# EAGLE schematic Shopfloor HP Molex NEW (EAGLE 9.6.2)
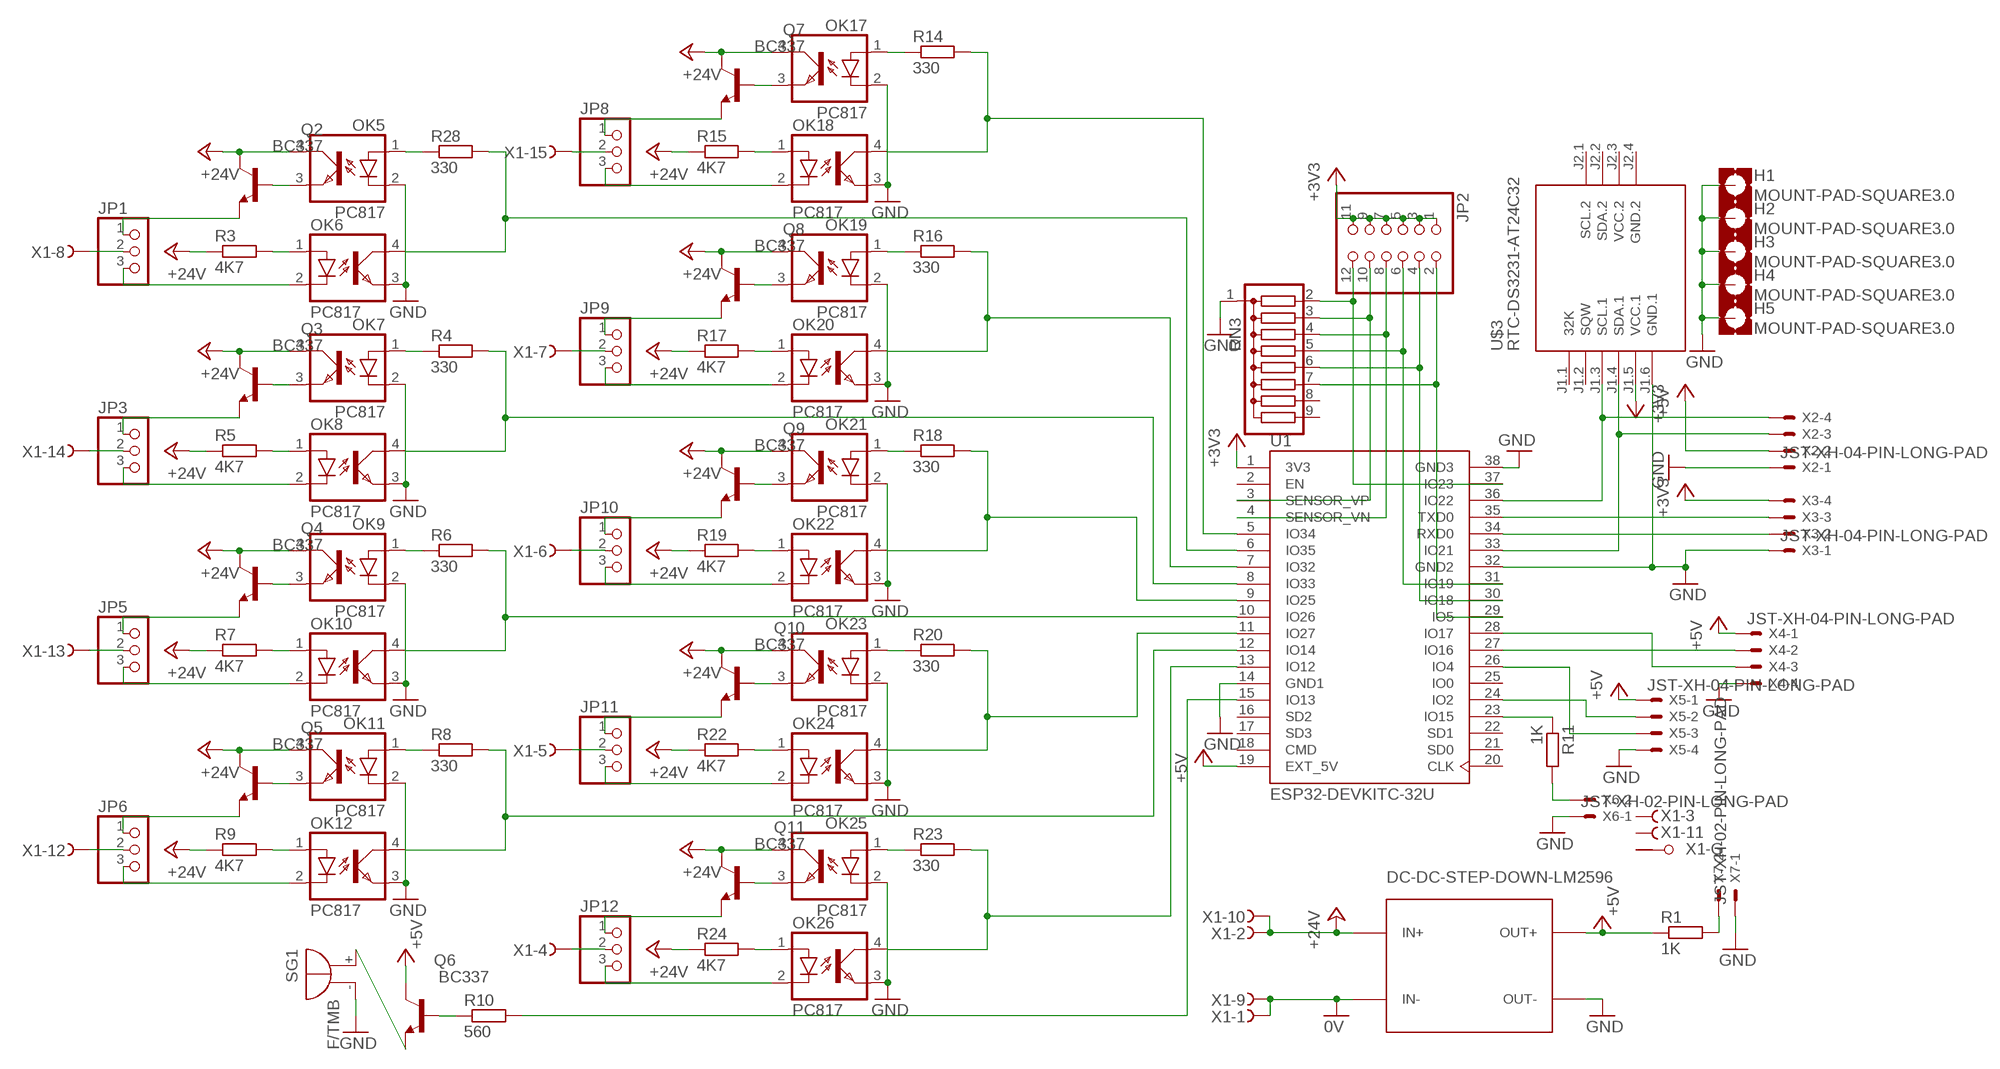
[diagram p0: schematic, sheet 1]

## Parts
H1  MOUNT-PAD-SQUARE3.0  [3,0-PAD-SQUARE]
H2  MOUNT-PAD-SQUARE3.0  [3,0-PAD-SQUARE]
H3  MOUNT-PAD-SQUARE3.0  [3,0-PAD-SQUARE]
H4  MOUNT-PAD-SQUARE3.0  [3,0-PAD-SQUARE]
H5  MOUNT-PAD-SQUARE3.0  [3,0-PAD-SQUARE]
JP1  PINHD-1X3  [1X03]
JP2  PINHD-2X6  [2X06]
JP3  PINHD-1X3  [1X03]
JP5  PINHD-1X3  [1X03]
JP6  PINHD-1X3  [1X03]
JP8  PINHD-1X3  [1X03]
JP9  PINHD-1X3  [1X03]
JP10  PINHD-1X3  [1X03]
JP11  PINHD-1X3  [1X03]
JP12  PINHD-1X3  [1X03]
OK5  PC817  [DIL04]
OK6  PC817  [DIL04]
OK7  PC817  [DIL04]
OK8  PC817  [DIL04]
OK9  PC817  [DIL04]
OK10  PC817  [DIL04]
OK11  PC817  [DIL04]
OK12  PC817  [DIL04]
OK17  PC817  [DIL04]
OK18  PC817  [DIL04]
OK19  PC817  [DIL04]
OK20  PC817  [DIL04]
OK21  PC817  [DIL04]
OK22  PC817  [DIL04]
OK23  PC817  [DIL04]
OK24  PC817  [DIL04]
OK25  PC817  [DIL04]
OK26  PC817  [DIL04]
Q2  BC337  [TO92]
Q3  BC337  [TO92]
Q4  BC337  [TO92]
Q5  BC337  [TO92]
Q6  BC337  [TO92]
Q7  BC337  [TO92]
Q8  BC337  [TO92]
Q9  BC337  [TO92]
Q10  BC337  [TO92]
Q11  BC337  [TO92]
R1  1K  R-EU_0207/7  [0207/7]
R3  4K7  R-EU_0207/7  [0207/7]
R4  330  R-EU_0207/7  [0207/7]
R5  4K7  R-EU_0207/7  [0207/7]
R6  330  R-EU_0207/7  [0207/7]
R7  4K7  R-EU_0207/7  [0207/7]
R8  330  R-EU_0207/7  [0207/7]
R9  4K7  R-EU_0207/7  [0207/7]
R10  560  R-EU_0207/7  [0207/7]
R11  1K  R-EU_0207/7  [0207/7]
R14  330  R-EU_0207/7  [0207/7]
R15  4K7  R-EU_0207/7  [0207/7]
R16  330  R-EU_0207/7  [0207/7]
R17  4K7  R-EU_0207/7  [0207/7]
R18  330  R-EU_0207/7  [0207/7]
R19  4K7  R-EU_0207/7  [0207/7]
R20  330  R-EU_0207/7  [0207/7]
R22  4K7  R-EU_0207/7  [0207/7]
R23  330  R-EU_0207/7  [0207/7]
R24  4K7  R-EU_0207/7  [0207/7]
R28  330  R-EU_0207/7  [0207/7]
RN3  G08R  [SIL9]
SG1  F/TMB  [F/TMB]
U1  ESP32-DEVKITC-32U  [MODULE_ESP32-DEVKITC-32U]
U$1  DC-DC-STEP-DOWN-LM2596  [DC-DC-STEP-DOWN-LM2596]
U$3  RTC-DS3231-AT24C32  [RTC-DS3231-AT24C32]
X1  F15HPS  [F15HP]
X2  JST-XH-04-PIN-LONG-PAD  [JST-XH-04-PACKAGE-LONG-PAD]
X3  JST-XH-04-PIN-LONG-PAD  [JST-XH-04-PACKAGE-LONG-PAD]
X4  JST-XH-04-PIN-LONG-PAD  [JST-XH-04-PACKAGE-LONG-PAD]
X5  JST-XH-04-PIN-LONG-PAD  [JST-XH-04-PACKAGE-LONG-PAD]
X6  JST-XH-02-PIN-LONG-PAD  [JST-XH-02-PACKAGE-LONG-PAD]
X7  JST-XH-02-PIN-LONG-PAD  [JST-XH-02-PACKAGE-LONG-PAD]

## Nets
0V: U$1.IN- X1.1(-1:F) X1.9(-9:F)
+3V3: JP2.1 JP2.3 JP2.5 JP2.7 JP2.9 JP2.11 U1.1(3V3) U$3.J1.5(VCC.1) X3.4
+5V: Q6.3(C) R1.1 U1.19(EXT_5V) U$1.OUT+ X2.2 X4.1 X5.1
+24V: OK5.4(COL) OK7.4(COL) OK9.4(COL) OK11.4(COL) OK17.4(COL) OK19.4(COL) OK21.4(COL) OK23.4(COL) OK25.4(COL) Q2.3(C) Q3.3(C) Q4.3(C) Q5.3(C) Q7.3(C) Q8.3(C) Q9.3(C) Q10.3(C) Q11.3(C) R3.1 R5.1 R7.1 R9.1 R15.1 R17.1 R19.1 R22.1 R24.1 U$1.IN+ X1.2(-2:F) X1.10(-10:F)
GND: H1.B3,0(MOUNT) H2.B3,0(MOUNT) H3.B3,0(MOUNT) H4.B3,0(MOUNT) H5.B3,0(MOUNT) OK5.2(C) OK6.3(EMIT) OK7.2(C) OK8.3(EMIT) OK9.2(C) OK10.3(EMIT) OK11.2(C) OK12.3(EMIT) OK17.2(C) OK18.3(EMIT) OK19.2(C) OK20.3(EMIT) OK21.2(C) OK22.3(EMIT) OK23.2(C) OK24.3(EMIT) OK25.2(C) OK26.3(EMIT) RN3.1 SG1.- U1.14(GND1) U1.32(GND2) U1.38(GND3) U$1.OUT- U$3.J1.6(GND.1) X2.1 X3.1 X4.4 X5.4 X6.1 X7.1
N$1: U1.35(TXD0) X3.3
N$2: JP2.12 RN3.2 U1.37(IO23)
N$3: R11.2 X6.2
N$4: JP1.2 X1.8(-8:F)
N$5: U1.27(IO16) X4.2
N$6: JP2.10 RN3.3 U1.3(SENSOR_VP)
N$7: JP2.8 RN3.4 U1.4(SENSOR_VN)
N$8: JP2.6 RN3.5 U1.31(IO19)
N$9: U1.26(IO4) X5.3
N$10: U1.24(IO2) X5.2
N$11: R11.1 U1.23(IO15)
N$12: Q6.2(B) R10.1
N$13: JP2.4 RN3.6 U1.30(IO18)
N$14: Q6.1(E) SG1.+
N$15: JP8.2 X1.15(-15:F)
N$16: R1.2 X7.2
N$17: JP2.2 RN3.7 U1.29(IO5)
N$19: OK6.4(COL) R28.2 U1.6(IO35)
N$20: OK20.4(COL) R16.2 U1.7(IO32)
N$21: OK8.4(COL) R4.2 U1.8(IO33)
N$22: OK22.4(COL) R18.2 U1.9(IO25)
N$23: OK10.4(COL) R6.2 U1.10(IO26)
N$24: OK24.4(COL) R20.2 U1.11(IO27)
N$25: U1.28(IO17) X4.3
N$26: OK12.4(COL) R8.2 U1.12(IO14)
N$27: U1.33(IO21) U$3.J1.4(SDA.1) X2.3
N$28: OK26.4(COL) R23.2 U1.13(IO12)
N$29: U1.36(IO22) U$3.J1.3(SCL.1) X2.4
N$30: R10.2 U1.15(IO13)
N$31: OK5.1(A) R28.1
N$32: OK5.3(EMIT) Q2.2(B)
N$33: OK6.1(A) R3.2
N$34: JP1.1 Q2.1(E)
N$35: JP1.3 OK6.2(C)
N$36: JP9.2 X1.7(-7:F)
N$37: OK7.1(A) R4.1
N$38: OK7.3(EMIT) Q3.2(B)
N$39: OK8.1(A) R5.2
N$40: JP3.1 Q3.1(E)
N$41: JP3.3 OK8.2(C)
N$42: JP10.2 X1.6(-6:F)
N$43: OK9.1(A) R6.1
N$44: OK9.3(EMIT) Q4.2(B)
N$45: OK10.1(A) R7.2
N$46: U1.34(RXD0) X3.2
N$47: JP5.1 Q4.1(E)
N$48: JP5.3 OK10.2(C)
N$49: JP11.2 X1.5(-5:F)
N$50: OK11.1(A) R8.1
N$51: OK11.3(EMIT) Q5.2(B)
N$52: OK12.1(A) R9.2
N$53: JP6.1 Q5.1(E)
N$54: JP6.3 OK12.2(C)
N$55: OK18.4(COL) R14.2 U1.5(IO34)
N$56: JP12.2 X1.4(-4:F)
N$63: OK17.1(A) R14.1
N$64: OK17.3(EMIT) Q7.2(B)
N$65: OK18.1(A) R15.2
N$66: JP8.1 Q7.1(E)
N$68: JP8.3 OK18.2(C)
N$69: JP6.2 X1.12(-12:F)
N$70: OK19.1(A) R16.1
N$71: OK19.3(EMIT) Q8.2(B)
N$72: OK20.1(A) R17.2
N$73: JP9.1 Q8.1(E)
N$74: JP9.3 OK20.2(C)
N$75: JP5.2 X1.13(-13:F)
N$76: OK21.1(A) R18.1
N$77: OK21.3(EMIT) Q9.2(B)
N$78: OK22.1(A) R19.2
N$79: JP10.1 Q9.1(E)
N$80: JP10.3 OK22.2(C)
N$81: JP3.2 X1.14(-14:F)
N$82: OK23.1(A) R20.1
N$83: OK23.3(EMIT) Q10.2(B)
N$84: OK24.1(A) R22.2
N$85: JP11.1 Q10.1(E)
N$86: JP11.3 OK24.2(C)
N$88: OK25.1(A) R23.1
N$89: OK25.3(EMIT) Q11.2(B)
N$90: OK26.1(A) R24.2
N$91: JP12.1 Q11.1(E)
N$92: JP12.3 OK26.2(C)
Unconnected: RN3.8 RN3.9 U1.2(EN) U1.16(SD2) U1.17(SD3) U1.18(CMD) U1.20(CLK) U1.21(SD0) U1.22(SD1) U1.25(IO0) U$3.J1.1(32K) U$3.J1.2(SQW) U$3.J2.1(SCL.2) U$3.J2.2(SDA.2) X1.3(-3:F) X1.11(-11:F) X1.G1(-G:G1) X1.G2(-G:G2)

## Power pins joined to a net without a drawn wire
GND.2: U$3.J2.4(GND.2)
VCC.2: U$3.J2.3(VCC.2)

## Library data of the parts
H1-H5 = holes:MOUNT-PAD-SQUARE: MOUNTING PAD, square
JP1 JP3 JP5 JP6 JP8-JP12 = pinhead:PINHD-1X3: PIN HEADER
JP2 = pinhead:PINHD-2X6: PIN HEADER
OK5-OK12 OK17-OK26 = optocoupler:PC817: SHARP OPTO COUPLER; MPN: PC817X4J000F; OC_FARNELL: 9707727; OC_NEWARK: 97K7059
Q2-Q11 = transistor-npn:BC337*: NPN Transistor
R1 R3-R11 R14-R20 R22-R24 R28 = rcl:R-EU_: RESISTOR, European symbol; SPICEPREFIX: R
RN3 = resistor-sil:G08R: SIL RESISTOR; OC_FARNELL: unknown; OC_NEWARK: unknown
SG1 = buzzer:F/TMB: BUZZER Source: Buerklin; OC_FARNELL: unknown; OC_NEWARK: unknown
U1 = ESP32-DEVKITC-32U:ESP32-DEVKITC-32U: ESP32-DEVKITC Check prices <https://pricing.snapeda.com/parts/ESP32-DEVKITC-32U/Espressif%20Systems/view-part?ref=eda>; AVAILABILITY: In Stock; DESCRIPTION: ESP32-WROOM-32UE - Transceiver; 802.11 b/g/n (Wi-Fi, WiFi, WLAN), Bluetooth® Smart Ready 4.x Dual Mode Evaluation Board; MF: Espressif Systems; MP: ESP32-DEVKITC-32U; PACKAGE: None; PRICE: None
U$1 = diy-modules:DC-DC-STEP-DOWN-LM2596: DC/DC Step-Down Regulator based on LM2596-ADJ chip LM2596 datasheet available here: http://www.ti.com/lit/ds/symlink/lm2596.pdf Click here to find device on ebay.com <http://www.ebay.com/sch/lm2596+power+regulator>
U$3 = diy-modules-ori:RTC-DS3231-AT24C32: RTC Module with Battery and EEPROM based on DS3231 and AT24C32 chips Tutorial can be found here: https://edwardmallon.wordpress.com/2014/05/21/using-a-cheap-3-ds3231-rtc-at24c32-eeprom-from-ebay/ Click here to find device on ebay.com <http://www.ebay.com/sch/DS3231+AT24C32+module>
X1 = con-subd:F15HPS: SUB-D; OC_FARNELL: unknown; OC_NEWARK: unknown
X2-X5 = Rembrandt Electronics - JST XH Connectors v1-0:JST-XH-04-PIN: JST XH Connector 2 Pin Wire to board connector. Pitch: 2,54 mm, (0.100") Number of pins: 4 Created by Rembrandt Electronics www.rembrandtelectronics.com
X6 X7 = Rembrandt Electronics - JST XH Connectors v1-0:JST-XH-02-PIN: JST XH Connector 2 Pin Wire to board connector. Pitch: 2,54 mm, (0.100") Number of pins: 2 Created by Rembrandt Electronics www.rembrandtelectronics.com